# EAGLE design UWB-Breakout (EAGLE 9.6.0)
CNAME: DWM1000 Breakout; CREVISION: 1.0; DESIGNER: Jedidiah Hodson
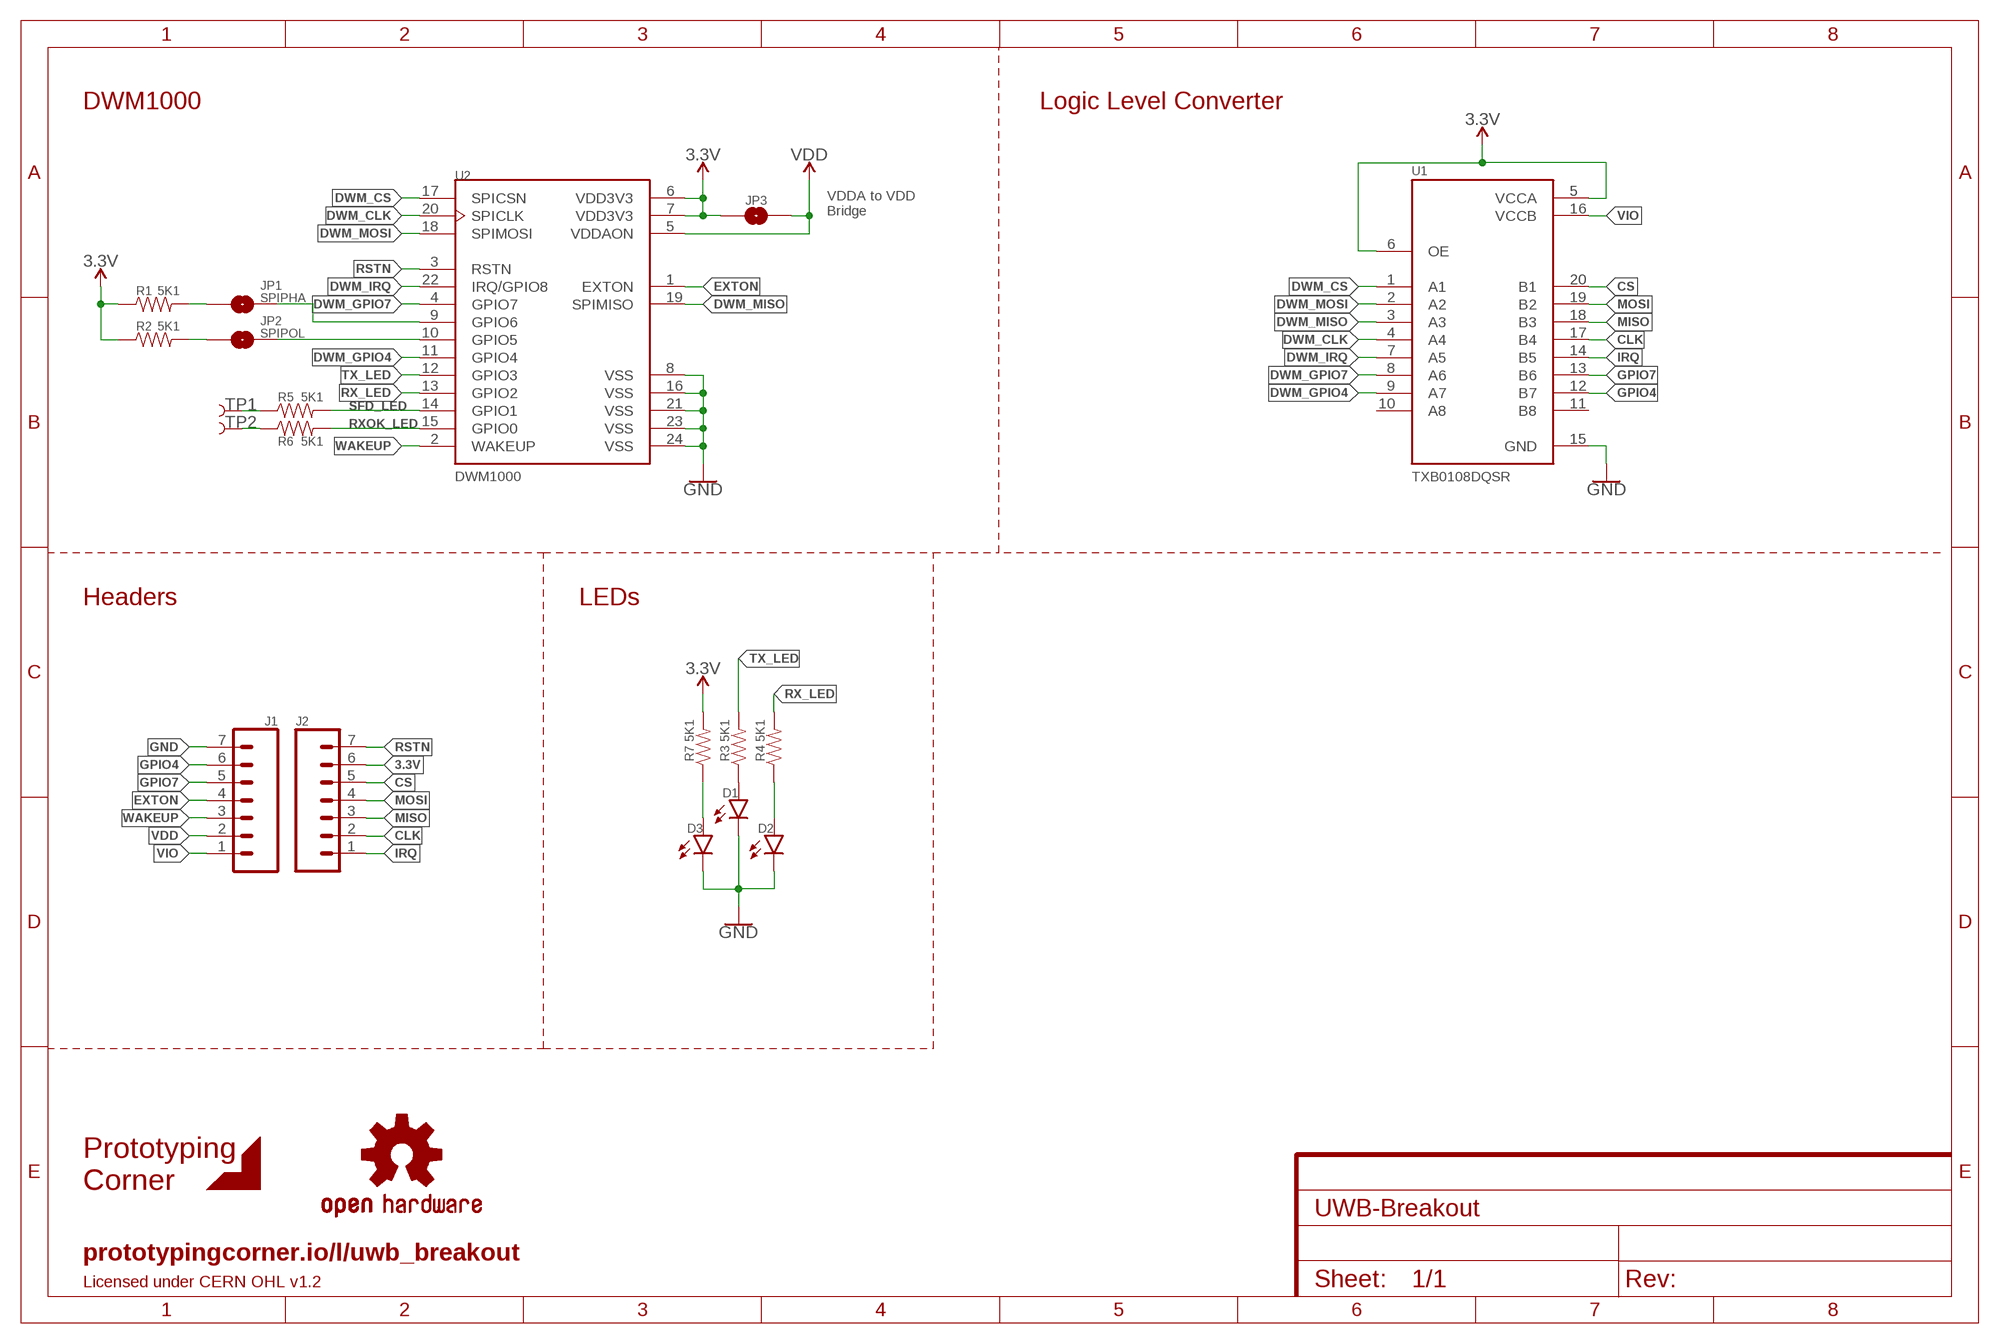
[diagram p0: schematic, sheet 1]

## Parts
D1  Yellow  LED-YELLOW0603  [LED-0603]
D2  GREEN  LED-GREEN0603  [LED-0603]
D3  BLUE  LED-BLUE0603  [LED-0603]
J1  CONN_07NO_SILK  [1X07_NO_SILK]
J2  CONN_07NO_SILK  [1X07_NO_SILK]
JP1  SPIPHA  JUMPER-SMT_2_NO_SILK  [SMT-JUMPER_2_NO_SILK]
JP2  SPIPOL  JUMPER-SMT_2_NO_SILK  [SMT-JUMPER_2_NO_SILK]
JP3  JUMPER-SMT_2_NO_SILK  [SMT-JUMPER_2_NO_SILK]
LOGO1  OSHW-LOGOM  [OSHW-LOGO-M]
R1  5K1  RESISTOR0603  [0603]
R2  5K1  RESISTOR0603  [0603]
R3  5K1  RESISTOR0603  [0603]
R4  5K1  RESISTOR0603  [0603]
R5  5K1  RESISTOR0603  [0603]
R6  5K1  RESISTOR0603  [0603]
R7  5K1  RESISTOR0603  [0603]
TP1  TEST-POINT3X5  [PAD.03X.05]
TP2  TEST-POINT3X5  [PAD.03X.05]
U1  TXB0108DQSR  [SON40P400X200X55-20N]
U2  DWM1000  [XCVR_DWM1000]

## Nets
3.3V: J2.6 JP3.1 R1.1 R2.1 R7.2 U1.5(VCCA) U1.6(OE) U2.6(VDD3V3) U2.7(VDD3V3)
CLK: J2.2 U1.17(B4)
CS: J2.5 U1.20(B1)
DWM_CLK: U1.4(A4) U2.20(SPICLK)
DWM_CS: U1.1(A1) U2.17(SPICSN)
DWM_GPIO4: U1.9(A7) U2.11(GPIO4)
DWM_GPIO7: U1.8(A6) U2.4(GPIO7)
DWM_IRQ: U1.7(A5) U2.22(IRQ/GPIO8)
DWM_MISO: U1.3(A3) U2.19(SPIMISO)
DWM_MOSI: U1.2(A2) U2.18(SPIMOSI)
EXTON: J1.4 U2.1(EXTON)
GND: D1.C D2.C D3.C J1.7 U1.15(GND) U2.8(VSS) U2.16(VSS) U2.21(VSS) U2.23(VSS) U2.24(VSS)
GPIO4: J1.6 U1.12(B7)
GPIO7: J1.5 U1.13(B6)
IRQ: J2.1 U1.14(B5)
MISO: J2.3 U1.18(B3)
MOSI: J2.4 U1.19(B2)
N$1: D3.A R7.1
N$2: D1.A R3.1
N$3: JP1.2 U2.9(GPIO6)
N$4: JP2.2 U2.10(GPIO5)
N$5: JP1.1 R1.2
N$6: JP2.1 R2.2
N$7: R6.1 TP2.P$1
N$8: R5.1 TP1.P$1
N$9: D2.A R4.1
RSTN: J2.7 U2.3(RSTN)
RX_LED: R4.2 U2.13(GPIO2)
RXOK_LED: R6.2 U2.15(GPIO0)
SFD_LED: R5.2 U2.14(GPIO1)
TX_LED: R3.2 U2.12(GPIO3)
VDD: J1.2 JP3.2 U2.5(VDDAON)
VIO: J1.1 U1.16(VCCB)
WAKEUP: J1.3 U2.2(WAKEUP)
Unconnected: U1.10(A8) U1.11(B8)

## Notes on the sheet
- DWM1000 | Logic Level Converter
- VDDA to VDD
  Bridge
- Headers | LEDs
- Prototyping
  Corner
- prototypingcorner.io/l/uwb_breakout
- Licensed under CERN OHL v1.2

## Library data of the parts
D1 = SparkFun-LED:LED-YELLOW: Yellow SMD LED Used in manufacturing several products at SparkFun. Packages: 0603 - SMD 0603 package[Product Link] <http://www.kingbrightusa.com/product.asp?catalog_name=LED&product_id=APT1608SYCK> 0603 -SMART - SMART SMD 0603 package (more efficient/more expensive) [Product Link] <http://www.osram-os.com/osram_os/en/products/product-catalog/led-light-emitting-diodes/smartled-0603/ly-l29k/index.jsp> LilyPad - SMD1206 package[Product Datasheet] <https://www.sparkfun.com/datasheets/DevTools/LilyPad/Q150YUS4.pdf> SparkFun Products: Blynk Board <https://www.sparkfun.com/products/13794> IOIO-OTG <https://www.sparkfun.com/products/13613> XBee Explorer Serial <https://www.sparkfun.com/products/13225>; PROD_ID: DIO-09003
D2 = SparkFun-LED:LED-GREEN: Green SMD LED Used in manufacturing of various products at SparkFun Packages: 0603 - SMD 0603 package [Product Link] <http://www.futureelectronics.com/en/technologies/semiconductors/optoelectronics/leds/Pages/9894312-LTST-C190GKT.aspx?CrossPart=HSMG-C190&IM=0> LilyPad 1206 - SMD1206 LilyPad package [Product Link] <http://www.futureelectronics.com/en/Technologies/Product.aspx?ProductID=IN150NGHARVATEKCORPORATION2049943&IM=0> 1206 - SMD1206 package [Product Link] <http://www.futureelectronics.com/en/technologies/semiconductors/optoelectronics/leds/Pages/8315665-LTST-C150KGKT.aspx?IM=0> 1206 Bottom Mount -SMD 1206 Bottom Mount [Product Link] <http://www.digikey.com/product-detail/en/lite-on-inc/LTST-C230KGKT/160-1456-1-ND/386854> SparkFun Products: Pro Mini 328 -5V <https://www.sparkfun.com/products/821> RedBoard <https://www.sparkfun.com/products/12757> MP3 Trigger <https://www.sparkfun.com/products/13720> Makey Makey <https://www.sparkfun.com/products/11076>; PROD_ID: DIO-00821
D3 = SparkFun-LED:LED-BLUE: Blue SMD LED Used in manufacturing of various products at SparkFun Packages: 0603 - SMD 0603 package [Product Link] <http://www.digikey.com/product-detail/en/SMLE12BC7TT86/511-1589-2-ND/1641808> 1206 - SMD1206 package [Product Link] <http://www.digikey.com/product-detail/en/lite-on-inc/LTST-C150TBKT/160-1643-1-ND/573584> SparkFun Products: ESP8266 Thing-Dev Board <https://www.sparkfun.com/products/13711> RedBoard <https://www.sparkfun.com/products/12757>; PROD_ID: DIO-08575
J1 J2 = SparkFun-Connectors:CONN_07: Multi connection point. Often used as Generic Header-pin footprint for 0.1 inch spaced/style header connections On any of the 0.1 inch spaced packages, you can populate with these: Break Away Headers - Straight <https://www.sparkfun.com/products/116> (PRT-00116) Break Away Male Headers - Right Angle <https://www.sparkfun.com/products/553> (PRT-00553) Female Headers <https://www.sparkfun.com/products/115> (PRT-00115) Break Away Headers - Machine Pin <https://www.sparkfun.com/products/117> (PRT-00117) Break Away Female Headers - Swiss Machine Pin <https://www.sparkfun.com/products/743> (PRT-00743) For SCREWTERMINALS and SPRING TERMINALS visit here: Screw Terimnals on SparkFun.com <https://www.sparkfun.com/search/results?term=Screw+Terminals> (5mm/3.5mm/2.54mm spacing) This device is also useful as a general connection point to wire up your design to another part of your project. Our various solder wires solder well into these plated through hole pads. Hook-Up Wire - Assortment (Stranded, 22 AWG) <https://www.sparkfun.com/products/11375> (PRT-11375) Hook-Up Wire - Assortment (Solid Core, 22 AWG) <https://www.sparkfun.com/products/11367> (PRT-11367) View the entire wire category on our website here <https://www.sparkfun.com/categories/141> Special notes: Molex polarized connector foot print use with SKU : PRT-08231 with associated crimp pins and housings. 1MM SMD Version SKU: PRT-10208 NOTES ON THE VARIANTS LOCK and LOCK_LONGPADS... This footprint was designed to help hold the alignment of a through-hole component (i.e. 6-pin header) while soldering it into place. You may notice that each hole has been shifted either up or down by 0.005 of an inch from it's more standard position (which is a perfectly straight line). This slight alteration caused the pins (the squares in the middle) to touch the edges of the holes. Because they are alternating, it causes a "brace" to hold the component in place. 0.005 has proven to be the perfect amount of "off-center" position when using our standard breakaway headers. Although looks a little odd when you look at the bare footprint, once you have a header in there, the alteration is very hard to notice. Also,if you push a header all the way into place, it is covered up entirely on the bottom side.
JP1-JP3 = SparkFun-Jumpers:JUMPER-SMT_2_NO: Normally open jumper This jumper has two pads in close proximity to each other. Apply solder to close the connection. Round pads are easier to solder for beginners, but are a lot larger. SparkFun Product that uses the round pads: SparkFun EL Sequencer <https://www.sparkfun.com/products/12781>
LOGO1 = SparkFun-Aesthetics:OSHW-LOGO: Open-Source Hardware (OSHW) Logo This logo indicates the piece of hardware it is found on incorporates a OSHW license and/or adheres to the definition of open source hardware found here: http://freedomdefined.org/OSHW
R1-R7 = SparkFun-Resistors:RESISTOR: Generic Resistor Package
TP1 TP2 = SparkFun-Connectors:TEST-POINT: SparkFun Test Points Bare copper test points for troubleshooting or In-Circuit-Testing. These are used by our Production team for verifying production board runs using pogo-pins on test beds. SparkFun Products: SparkFun LSM9DS1 Breakout <https://www.sparkfun.com/products/13284> SparkFun PSOC <https://www.sparkfun.com/products/13714> SparkFun Load Cell Amplifier <https://www.sparkfun.com/products/13879>
U1 = TXB0108DQSR:TXB0108DQSR: IC V-LEVEL XLATR 8B ESD 20USON; DESCRIPTION: Voltage Level Translator Bidirectional 1 Circuit 8 Channel 100Mbps 20-USON _4x2_; DIGI-KEY_PART_NUMBER: 296-27217-1-ND; DIGI-KEY_PURCHASE_URL: https://www.digikey.com.au/product-detail/en/texas-instruments/TXB0108DQSR/296-27217-1-ND/2260595?utm_source=snapeda&utm_medium=aggregator&utm_campaign=symbol; MF: Texas Instruments; MP: TXB0108DQSR; PACKAGE: UFDFN-20 Texas Instruments
U2 = DWM1000:DWM1000: Mod Ieee802.15.4-2011 Uwb Txrx; AVAILABILITY: Unavailable; DESCRIPTION: Mod Ieee802.15.4-2011 Uwb Txrx; MF: Decawave Limited; MP: DWM1000; PACKAGE: Module Decawave; PRICE: None

## Board
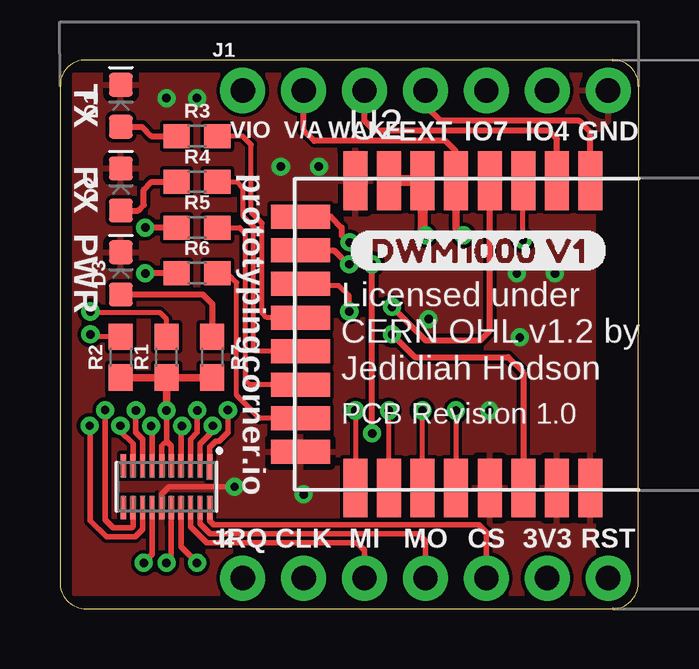
[diagram p1: board, top side]
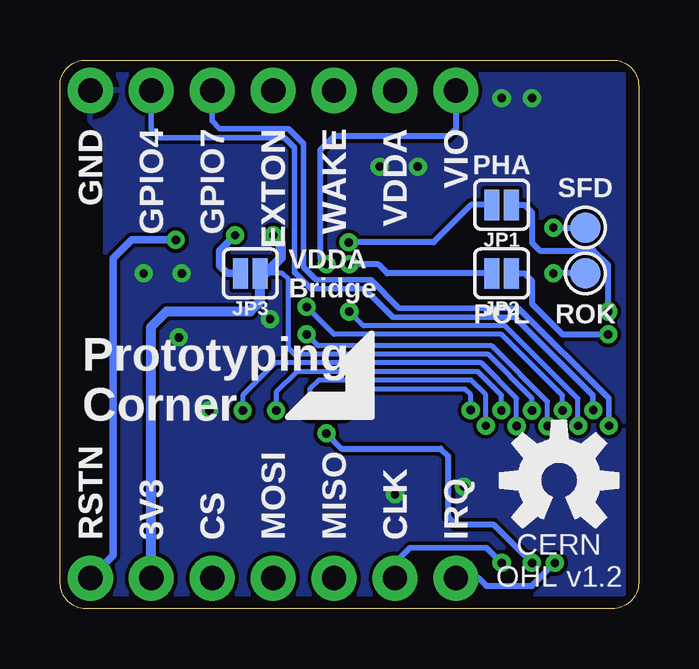
[diagram p2: board, bottom side, seen from below]

Size 24.13 x 22.86 mm. Coordinates in mm from the lower left corner, seen from the top.
Outline: 23.05,22.86 1.08,22.86 arc90 0,21.78 0,1.08 arc90 1.08,0 23.06,0 arc90 24.11,1.05 24.13,21.78 arc90 23.05,22.86
Copper layers (1*16): Top 0.035mm / dielectric 1.5mm / Bottom 0.035mm
Design rules "default *": minimum track width 6mil, minimum drill 0.35mm, track to track 6mil, track to pad 6mil, pad to pad 6mil, via to via 6mil, smd to smd 6mil, copper to edge 0.25mm, drill to drill 6mil, minimum pad ring 10mil, minimum via ring 8mil, stop-mask expansion 4mil, vias tented up to drill 40mil, thermal gap 10mil

### Footprints (pad centres in the part's own frame; a part is rotated, then mirrored left to right if it is on the bottom)
LED-0603 = smd 1 x 1: A -0.877,0; C 0.877,0
1X07_NO_SILK = drill 1.016 pad 1.88: 1 0,0; 2 2.54,0; 3 5.08,0; 4 7.62,0; 5 10.16,0; 6 12.7,0; 7 15.24,0
SMT-JUMPER_2_NO_SILK = smd 0.635 x 1.27: 1 -0.406,0; 2 0.406,0
0603 = smd 1.1 x 1: 1 -0.85,0; 2 0.85,0
PAD.03X.05 = smd 1.27 x 1.27: P$1 0,0
SON40P400X200X55-20N = smd 1.06 x 0.22: 1 -0.82,1.8 | smd 0.96 x 0.22: 2 -0.87,1.4; 3 -0.87,1; 4 -0.87,0.6; 5 -0.87,0.2; 6 -0.87,-0.2; 7 -0.87,-0.6; 8 -0.87,-1; 9 -0.87,-1.4; 10 -0.87,-1.8; 11 0.87,-1.8; 12 0.87,-1.4; 13 0.87,-1; 14 0.87,-0.6; 15 0.87,-0.2; 16 0.87,0.2; 17 0.87,0.6; 18 0.87,1; 19 0.87,1.4; 20 0.87,1.8
XCVR_DWM1000 = smd 2.45 x 1: 1 -6.4,1.8; 2 -6.4,0.4; 3 -6.4,-1; 4 -6.4,-2.4; 5 -6.4,-3.8; 6 -6.4,-5.2; 7 -6.4,-6.6; 8 -6.4,-8; 17 6.4,-8; 18 6.4,-6.6; 19 6.4,-5.2; 20 6.4,-3.8; 21 6.4,-2.4; 22 6.4,-1; 23 6.4,0.4; 24 6.4,1.8 | smd 1 x 2.45: 9 -4.9,-10.295; 10 -3.5,-10.295; 11 -2.1,-10.295; 12 -0.7,-10.295; 13 0.7,-10.295; 14 2.1,-10.295; 15 3.5,-10.295; 16 4.9,-10.295

### Placement (x,y rotation side)
D1  2.54,20.95 90 top
D2  2.54,17.46 90 top
D3  2.54,13.97 90 top
J1  7.62,21.59 0 top
J2  7.62,1.27 0 top
JP1  5.71,16.83 180 bottom
JP2  5.71,13.97 180 bottom
JP3  16.19,13.97 180 bottom
LOGO1  3.31,5.35 0 bottom
R1  4.45,10.48 90 top
R2  2.54,10.48 90 top
R3  5.71,19.68 0 top
R4  5.71,17.78 0 top
R5  5.71,15.88 0 top
R6  5.71,13.97 0 top
R7  6.35,10.48 270 top
TP1  2.22,15.88 0 bottom
TP2  2.22,13.97 0 bottom
U1  4.45,5.08 270 top
U2  20.32,11.43 270 top
U$1  [DWM1000_V10]  12.06,14.92 0 top

### Tracks (layer width: path | path; a pad name or v marks a point on that pad's centre or on a via)
3.3V  (via drill 0.35)
  Top 0.221: U1.6 4.25,6.79 4.45,6.99 | U1.5 4.64,6.79 4.45,6.99 | 4.45,6.99 v4.45,8.26
  Top 0.305: R2.1 R1.1 | R7.2 R1.1 | R1.1 v4.45,8.26
  Top 0.406: U2.6 15.12,15.68 v15.24,15.56
  Top 0.457: U2.6 U2.7
  Bottom 0.203: v4.45,8.26 4.45,8.76 6.27,10.59 14.35,10.59 14.61,10.85 14.61,13.72 14.86,13.97 JP3.1
  Bottom 0.406: v15.24,15.56 14.92,15.24 14.92,14.61 15.56,13.97 JP3.1 15.79,12.79 16.19,12.38 19.68,12.38 20.32,11.75 J2.6
CLK  (via drill 0.35)
  Top 0.221: U1.17 5.04,2.86 5.04,2.58 v5.71,1.91
  Bottom 0.221: v5.71,1.91 6.35,2.54 9.53,2.54 10.16,1.91 J2.2
CS
  Top 0.221: U1.20 6.25,3.66 6.41,3.49 17.46,3.49 17.78,3.17 J2.5
DWM_CLK  (via drill 0.35)
  Top 0.203: v16.51,8.26 16.52,8.24 U2.20
  Top 0.221: U1.4 5.04,7.57 v5.09,7.61
  Bottom 0.203: v5.09,7.61 5.09,8.77 6.56,10.24 15.16,10.24 16.51,8.89 v16.51,8.26
DWM_CS  (via drill 0.35)
  Top 0.203: v12.32,8.26 U2.17
  Top 0.221: U1.1 6.25,6.73 6.49,6.98 6.63,6.98 7.01,7.35 v7.01,8.26 v7,8.27
  Bottom 0.203: v7,8.27 7,8.91 7.24,9.14 11.81,9.14 12.32,8.64 v12.32,8.26
DWM_GPIO4  (via drill 0.35)
  Top 0.203: U2.11 10.09,13.46 11.62,13.46 12.06,13.02 v12.06,12.38
  Top 0.221: U1.9 3.04,6.86 2.52,7.39 v2.52,7.62
  Bottom 0.203: v2.52,7.62 2.54,7.63 2.54,8.75 5.57,11.79 11.47,11.79 v12.06,12.38
DWM_GPIO7  (via drill 0.35)
  Top 0.221: U1.8 3.44,7.06 3.16,7.35 v3.16,8.26 v3.17,8.26
  Top 0.254: v13.84,12.57 15.24,11.18 17.53,11.18 17.92,11.57 U2.4
  Bottom 0.203: v3.17,8.26 v3.17,8.27 3.17,8.89 5.71,11.43 12.7,11.43 v13.84,12.57
DWM_IRQ  (via drill 0.35)
  Top 0.221: U1.7 3.85,7.57 v3.8,7.61
  Top 0.254: v13.84,11.43 14.8,10.48 18.68,10.48 19.32,9.84 U2.22
  Bottom 0.203: v3.8,7.61 3.8,8.62 6.13,10.95 13.36,10.95 v13.84,11.43
DWM_MISO  (via drill 0.35)
  Top 0.203: U2.19 15.12,8.25 v15.11,8.26
  Top 0.221: U1.3 5.45,7.06 5.73,7.35 v5.73,8.26 v5.72,8.26
  Bottom 0.203: v5.72,8.26 v5.71,8.27 5.71,8.89 6.71,9.88 14.25,9.88 15.11,9.02 v15.11,8.26
DWM_MOSI  (via drill 0.35)
  Top 0.203: U2.18 v13.72,8.25 v13.72,8.26
  Top 0.221: U1.2 5.84,6.86 6.37,7.39 v6.37,7.62
  Bottom 0.203: v6.37,7.62 6.37,8.91 6.99,9.53 13.34,9.53 13.72,9.14 v13.72,8.26
EXTON
  Top 0.254: U2.1 22.12,19.85 21.65,20.32 15.88,20.32 15.24,20.95 J1.4
GND  (via drill 0.35)
  Top 0.221: U1.15 4.25,4.77 4.55,5.08 v7.28,5.08
  other vias: 10.16,4.76 19.05,13.97 20.64,13.97 15.37,12.06 17.91,8.26 19.18,11.3 9.21,18.41 10.79,18.41 5.71,21.27 4.45,21.27
  pour Top: 0.64,22.23 22.86,22.23 22.86,20.32 22.23,19.68 22.23,0.64 0.64,0.64
  pour Bottom: 0.64,22.23 22.86,22.23 22.86,20.32 22.23,19.68 22.23,0.64 0.64,0.64
GPIO4  (via drill 0.35)
  Top 0.221: U1.12 3.04,3.43 2.98,3.37 2.22,3.37 1.88,3.71 1.88,7.89 1.89,7.89 v1.89,8.27
  Bottom 0.221: v1.89,8.27 1.91,8.29 1.91,8.89 5.17,12.15 10.24,12.15 11.43,13.34 13.65,13.34 14.34,14.03 14.34,19.21 14.76,19.63 19.95,19.63 20.32,20 J1.6
GPIO7  (via drill 0.35)
  Top 0.221: U1.13 3.44,3.3 3.14,2.99 1.94,2.99 1.27,3.66 1.27,7.59 v1.24,7.62
  Bottom 0.221: v1.24,7.62 v1.25,7.63 1.25,8.76 5.01,12.52 9.98,12.52 11.17,13.71 13.46,13.71 13.97,14.22 13.97,19.37 14.61,20 17.46,20 17.78,20.32 J1.5
IRQ  (via drill 0.35)
  Top 0.221: v3.49,1.91 3.85,2.26 U1.14
  Bottom 0.254: J2.1 6.67,1.27 6.35,0.95 4.45,0.95 v3.49,1.91
MISO
  Top 0.221: U1.18 5.45,3.4 6.1,2.75 12.38,2.75 12.7,2.43 J2.3
MOSI
  Top 0.221: U1.19 5.84,3.53 6.26,3.12 14.92,3.12 15.24,2.8 J2.4
N$1
  Top 0.254: D3.A 5.96,13.09 6.35,12.7 R7.1
N$2
  Top 0.254: D1.A 3.42,20.08 3.81,19.68 R3.1
N$3  (via drill 0.35)
  Top 0.254: U2.9 11.29,16.33 11.75,15.88 11.75,15.56 12.04,15.26 v12.09,15.26
  Bottom 0.254: JP1.2 6.99,16.83 8.55,15.26 v12.09,15.26 12.04,15.26
N$4  (via drill 0.35)
  Top 0.254: U2.10 11.42,14.93 12,14.35 v12.06,14.35
  Bottom 0.254: JP2.2 10.48,13.97 10.86,14.35 v12.06,14.35
N$5  (via drill 0.35)
  Top 0.203: R1.2 4.45,12.06 4.17,12.34 1.31,12.34 v1.27,12.38
  Bottom 0.254: v1.27,12.38 1.27,14.31 1.88,14.92 4.13,14.92 4.45,15.24 4.45,16.51 4.76,16.83 JP1.1
N$6  (via drill 0.35)
  Top 0.203: R2.2 1.37,11.33 v1.27,11.43
  Bottom 0.254: JP2.1 4.76,13.97 4.45,13.65 4.45,12.7 3.17,11.43 v1.27,11.43
N$7  (via drill 0.35)
  Top 0.254: R6.1 v3.56,13.97
  Bottom 0.254: TP2.P$1 v3.56,13.97
N$8  (via drill 0.35)
  Top 0.254: R5.1 v3.56,15.88
  Bottom 0.254: v3.56,15.88 TP1.P$1
N$9
  Top 0.254: D2.A 3.25,16.59 3.49,16.83 3.49,17.46 3.81,17.78 R4.1
N$11
  pour Top: 1.59,1.27 2.22,1.27 2.22,1.91 2.54,2.22 2.54,0.95 1.27,0.95
RSTN  (via drill 0.35)
  Top 0.203: v19.3,15.37 19.3,17.81 U2.3
  Bottom 0.305: J2.7 21.91,2.22 21.91,14.61 21.14,15.37 v19.3,15.37
RX_LED
  Top 0.203: U2.13 8.14,10.73 8.08,10.79 8.08,15.92 7.62,16.38 7.62,17.53 7.37,17.78 R4.2
RXOK_LED
  Top 0.203: U2.15 8.33,7.93 7.37,8.89 7.37,13.59 6.99,13.97 R6.2
SFD_LED
  Top 0.203: U2.14 7.92,9.33 7.72,9.53 7.72,15.64 7.49,15.88 R5.2
TX_LED
  Top 0.203: U2.12 8.62,12.13 8.44,12.32 8.44,16.07 7.98,16.52 7.98,19.33 7.62,19.68 R3.2
VDD  (via drill 0.35)
  Top 0.254: U2.5 16.51,19.05 16.07,19.49 10.6,19.49 10.16,19.94 J1.2
  Top 0.305: U2.5 16.52,15.87 v16.83,15.56
  Bottom 0.305: v16.83,15.56 17.46,14.92 17.46,14.29 17.14,13.97 JP3.2
VIO  (via drill 0.35)
  Top 0.221: U1.16 4.64,2.1 v4.45,1.91
  Top 0.254: v13.02,7.3 v13.02,14.35
  Bottom 0.254: J1.1 7.62,20 7.94,19.68 12.7,19.68 13.27,19.11 13.27,14.61 v13.02,14.35 | v13.02,7.3 12.38,6.67 8.26,6.67 7.94,6.35 7.94,3.81 7.62,3.49 6.03,3.49 v4.45,1.91
WAKEUP
  Top 0.254: U2.2 20.72,19.58 20.38,19.91 13.11,19.91 12.7,20.32 J1.3

### Text on the board
tPlace: TX | VIO | V/A | WAKE | EXT | IO7 | IO4 | GND | RX | PWR | prototypingcorner.io | Licensed under / CERN OHL v1.2 by / Jedidiah Hodson | PCB Revision 1.0 | IRQ | CLK | MI | MO | CS | 3V3 | RST
bPlace: VIO | VDDA | WAKE | WAKE | EXTON | EXTON | GPIO7 | GPIO4 | GND | PHA | SFD | VDDA / Bridge | ROK | POL | Prototyping / Corner | CERN / OHL v1.2 | IRQ | CLK | CLK | MISO | MOSI | CS | CS | 3V3 | RSTN | RSTN